# Altium schematic sheet KEY4.SchDoc
size A
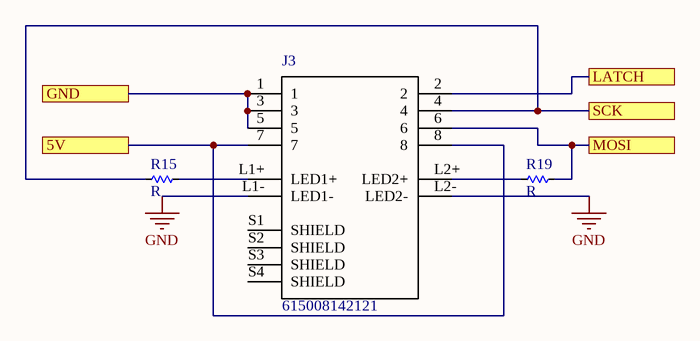
[diagram p0: KEY4.SchDoc]

## Parts
J3  615008142121  [RJ45_8P8C]
R15  R  [RES-SMD-0603_BIG]
R19  R  [RES-SMD-0603_BIG]

## Ports
5V, GND, LATCH, MOSI, SCK

## Nets
GND: J3.L1-(LED1-) J3.L2-(LED2-)
5V: J3.7 J3.8 ; port 5V
GND: J3.1 J3.3 J3.5 ; port GND  [a separate net that carries the same name]
LATCH: J3.2 ; port LATCH
MOSI: J3.6 R19.1 ; port MOSI
SCK: J3.4 R15.2 ; port SCK
NetJ3_L1+: J3.L1+(LED1+) R15.1
NetJ3_L2+: J3.L2+(LED2+) R19.2

Not connected (* = marked no-connect by the designer): J3 S1(SHIELD) S2(SHIELD) S3(SHIELD) S4(SHIELD)

## Library data of the parts
J3 = RJ45_8P8C: Conn, Rj45 Jack, Shld, 1port, 8p8c, Cat5; MF: WÃ¼rth Elektronik; MP: 615008142121; Price: None; Availability: Unavailable; SnapEDA_Link: https://www.snapeda.com/parts/615008142121/W%C3%BCrth%20Elektronik/view-part/1118273/?ref=snap; Package: None; Value: *